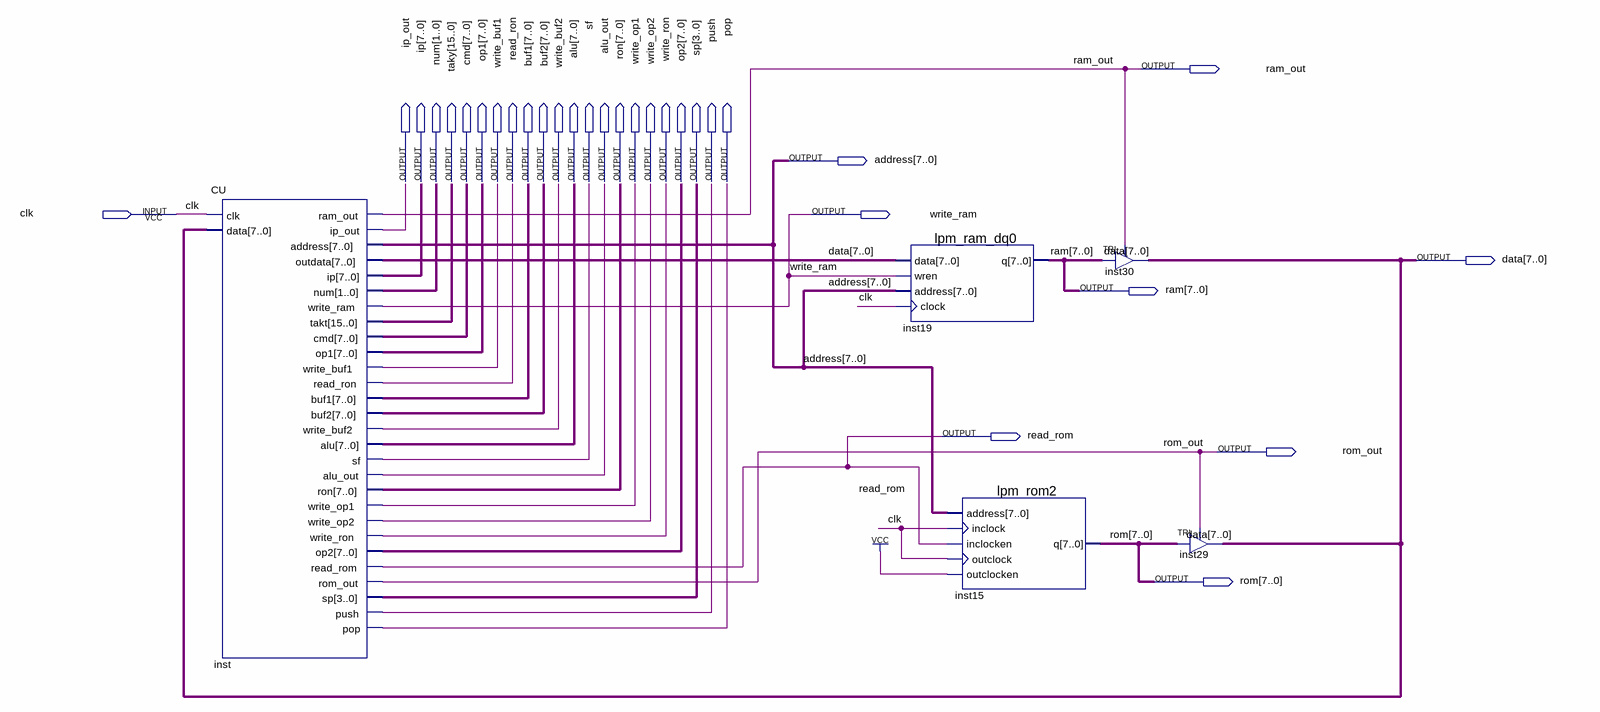
[diagram p0: schematic sheet]
// Quartus schematic cpu.bdf as structural Verilog: 5 symbols, 31 pins
module cpu (
  input  clk,
  output ram_out,
  output [7:0] address,
  output ip_out,
  output [7:0] ip,
  output [1:0] num,
  output [15:0] taky,
  output [7:0] cmd,
  output [7:0] op1,
  output write_buf1,
  output read_ron,
  output [7:0] buf1,
  output [7:0] buf2,
  output write_buf2,
  output [7:0] alu,
  output sf,
  output alu_out,
  output [7:0] ron,
  output write_op1,
  output write_op2,
  output write_ron,
  output [7:0] op2,
  output [3:0] sp,
  output push,
  output pop,
  output write_ram,
  output [7:0] data,
  output [7:0] ram,
  output read_rom,
  output rom_out,
  output [7:0] rom
);

  CU inst (
    .clk(clk), .data(data), .ram_out(ram_out), .ip_out(ip_out), .address(address), .outdata(data), .ip(ip),
    .num(num), .write_ram(write_ram), .takt(taky), .cmd(cmd), .op1(op1), .write_buf1(write_buf1),
    .read_ron(read_ron), .buf1(buf1), .buf2(buf2), .write_buf2(write_buf2), .alu(alu), .sf(sf),
    .alu_out(alu_out), .ron(ron), .write_op1(write_op1), .write_op2(write_op2), .write_ron(write_ron),
    .op2(op2), .read_rom(read_rom), .rom_out(rom_out), .sp(sp), .push(push), .pop(pop));
  lpm_ram_dq0 inst19 (.data(data), .wren(write_ram), .address(address), .clock(clk), .q(ram));
  lpm_rom2 inst15 (.address(address), .inclock(clk), .inclocken(read_rom), .outclock(clk), .outclocken(1'b1), .q(rom));
  TRI inst30[7:0] (.IN(ram), .OE(ram_out), .OUT(data));
  TRI inst29[7:0] (.IN(rom), .OE(rom_out), .OUT(data));
endmodule
